# Altium schematic sheet Sheet_Bott_Back.SchDoc: Sheet_Bott_Back
size A4; Organization: Altium Limited; Address1: L3, 12a Rodborough Rd; Address2: Frenchs Forest; Address3: NSW; Address4: Australia 2086
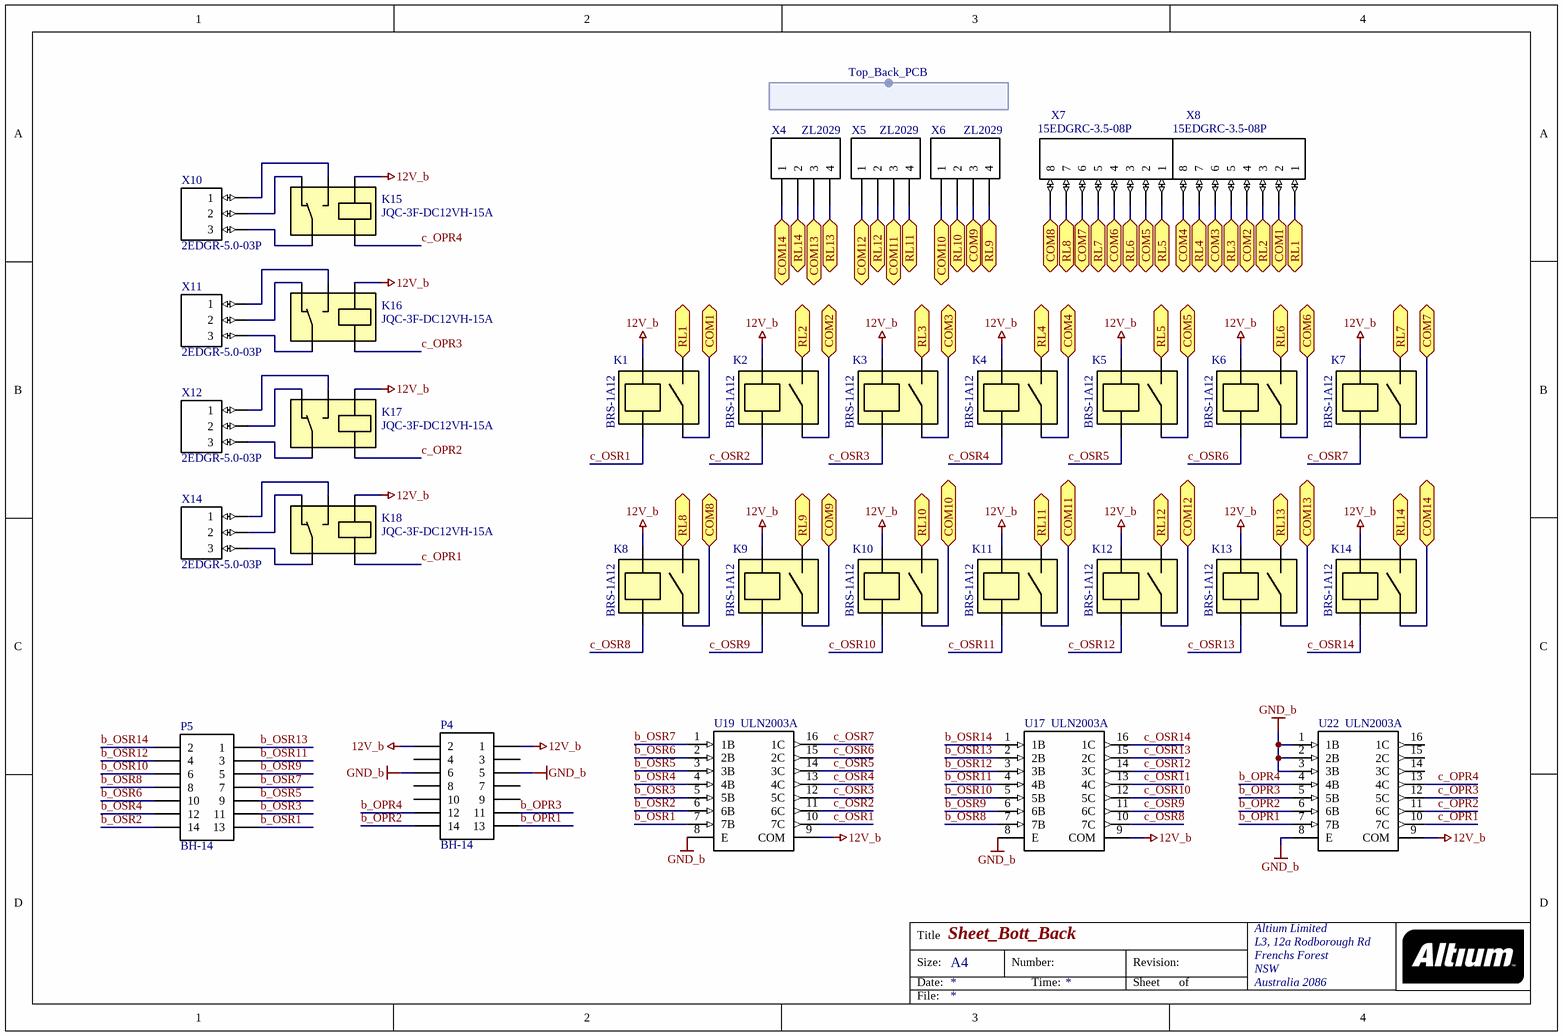
[diagram p0: Sheet_Bott_Back.SchDoc]

## Parts
K1  BRS-1A12  [R_BRS]
K2  BRS-1A12  [R_BRS]
K3  BRS-1A12  [R_BRS]
K4  BRS-1A12  [R_BRS]
K5  BRS-1A12  [R_BRS]
K6  BRS-1A12  [R_BRS]
K7  BRS-1A12  [R_BRS]
K8  BRS-1A12  [R_BRS]
K9  BRS-1A12  [R_BRS]
K10  BRS-1A12  [R_BRS]
K11  BRS-1A12  [R_BRS]
K12  BRS-1A12  [R_BRS]
K13  BRS-1A12  [R_BRS]
K14  BRS-1A12  [R_BRS]
K15  JQC-3F-DC12VH-15A  [BS-115C-12A]
K16  JQC-3F-DC12VH-15A  [BS-115C-12A]
K17  JQC-3F-DC12VH-15A  [BS-115C-12A]
K18  JQC-3F-DC12VH-15A  [BS-115C-12A]
P4  BH-14  [BH-14]
P5  BH-14  [BH-14]
U17  ULN2003A  [SO-16_N]
U19  ULN2003A  [SO-16_N]
U22  ULN2003A  [SO-16_N]
X4  PLS-4  [PLS-4-3D]  (value not drawn)
X5  PLS-4  [PLS-4-3D]  (value not drawn)
X6  PLS-4  [PLS-4-3D]  (value not drawn)
X7  15EDGRC-3.5-08P  [MC_3.5_8]
X8  15EDGRC-3.5-08P  [MC_3.5_8]
X10  2EDGR-5.0-03P  [2EDGR-5.0-03P]
X11  2EDGR-5.0-03P  [2EDGR-5.0-03P]
X12  2EDGR-5.0-03P  [2EDGR-5.0-03P]
X14  2EDGR-5.0-03P  [2EDGR-5.0-03P]

## Ports
COM1, COM2, COM3, COM4, COM5, COM6, COM7, COM8, COM9, COM10, COM11, COM12, COM13, COM14, RL1, RL2, RL3, RL4, RL5, RL6, RL7, RL8, RL9, RL10, RL11, RL12, RL13, RL14

## Harnesses
Top_Back_PCB: 

## Nets
12V_b: K1.3 K2.3 K3.3 K4.3 K5.3 K6.3 K7.3 K8.3 K9.3 K10.3 K11.3 K12.3 K13.3 K14.3 K15.1 K16.1 K17.1 K18.1 P4.1 P4.2 U17.9(COM) U19.9(COM) U22.9(COM)
GND_b: P4.5 P4.6 U17.8(E) U19.8(E) U22.1(1B) U22.2(2B) U22.3(3B) U22.8(E)
b_OPR1: P4.13 U22.7(7B)
b_OPR2: P4.14 U22.6(6B)
b_OPR3: P4.11 U22.5(5B)
b_OPR4: P4.12 U22.4(4B)
b_OSR1: P5.13 U19.7(7B)
b_OSR2: P5.14 U19.6(6B)
b_OSR3: P5.11 U19.5(5B)
b_OSR4: P5.12 U19.4(4B)
b_OSR5: P5.9 U19.3(3B)
b_OSR6: P5.10 U19.2(2B)
b_OSR7: P5.7 U19.1(1B)
b_OSR8: P5.8 U17.7(7B)
b_OSR9: P5.5 U17.6(6B)
b_OSR10: P5.6 U17.5(5B)
b_OSR11: P5.3 U17.4(4B)
b_OSR12: P5.4 U17.3(3B)
b_OSR13: P5.1 U17.2(2B)
b_OSR14: P5.2 U17.1(1B)
c_OPR1: K18.2 U22.10(7C)
c_OPR2: K17.2 U22.11(6C)
c_OPR3: K16.2 U22.12(5C)
c_OPR4: K15.2 U22.13(4C)
c_OSR1: K1.5 U19.10(7C)
c_OSR2: K2.5 U19.11(6C)
c_OSR3: K3.5 U19.12(5C)
c_OSR4: K4.5 U19.13(4C)
c_OSR5: K5.5 U19.14(3C)
c_OSR6: K6.5 U19.15(2C)
c_OSR7: K7.5 U19.16(1C)
c_OSR8: K8.5 U17.10(7C)
c_OSR9: K9.5 U17.11(6C)
c_OSR10: K10.5 U17.12(5C)
c_OSR11: K11.5 U17.13(4C)
c_OSR12: K12.5 U17.14(3C)
c_OSR13: K13.5 U17.15(2C)
c_OSR14: K14.5 U17.16(1C)
COM1: K1.7 X8.2 ; port COM1
COM2: K2.7 X8.4 ; port COM2
COM3: K3.7 X8.6 ; port COM3
COM4: K4.7 X8.8 ; port COM4
COM5: K5.7 X7.2 ; port COM5
COM6: K6.7 X7.4 ; port COM6
COM7: K7.7 X7.6 ; port COM7
COM8: K8.7 X7.8 ; port COM8
COM9: K9.7 X6.3 ; port COM9
COM10: K10.7 X6.1 ; port COM10
COM11: K11.7 X5.3 ; port COM11
COM12: K12.7 X5.1 ; port COM12
COM13: K13.7 X4.3 ; port COM13
COM14: K14.7 X4.1 ; port COM14
RL1: K1.1 X8.1 ; port RL1
RL2: K2.1 X8.3 ; port RL2
RL3: K3.1 X8.5 ; port RL3
RL4: K4.1 X8.7 ; port RL4
RL5: K5.1 X7.1 ; port RL5
RL6: K6.1 X7.3 ; port RL6
RL7: K7.1 X7.5 ; port RL7
RL8: K8.1 X7.7 ; port RL8
RL9: K9.1 X6.4 ; port RL9
RL10: K10.1 X6.2 ; port RL10
RL11: K11.1 X5.4 ; port RL11
RL12: K12.1 X5.2 ; port RL12
RL13: K13.1 X4.4 ; port RL13
RL14: K14.1 X4.2 ; port RL14
NetK15_3: K15.3 X10.3
NetK15_4: K15.4 X10.2
NetK15_5: K15.5 X10.1
NetK16_3: K16.3 X11.3
NetK16_4: K16.4 X11.2
NetK16_5: K16.5 X11.1
NetK17_3: K17.3 X12.3
NetK17_4: K17.4 X12.2
NetK17_5: K17.5 X12.1
NetK18_3: K18.3 X14.3
NetK18_4: K18.4 X14.2
NetK18_5: K18.5 X14.1

Not connected (* = marked no-connect by the designer): P4 3 4 7 8 9 10; U22 14(3C) 15(2C) 16(1C)

## Notes on the sheet
- Title
- Size:
- Date:
- A4
- Number:
- Time:
- Revision:
- Sheet
- of
- File:

## Library data of the parts
K1-K14 = BRS-1A12: 1A, 10Vdc, 1 pole, SIP terminal
K15-K18 = JQC-3F-DC12VH-7A: 7A 240Vac 1 pole Slim relay
P4 P5 = BH-14: IDC/BH; LatestRevisionDate: 17-Jul-2002; LatestRevisionNote: Re-released for DXP Platform.; Publisher: Altium Limited
U17 U19 U22 = ULN2003A: Darlington Transistor Arrays
X4-X6 = PLS-4: ZL2029; LatestRevisionDate: 17-Jul-2002; LatestRevisionNote: Re-released for DXP Platform.; Publisher: Altium Limited
X7 X8 = MC_3.5_8: Connector 3.5mm
X10-X12 X14 = 2EDGR-5.0-03P: Connector 5mm